# Altium schematic sheet DAC8802程控放大器.SchDoc
size A4
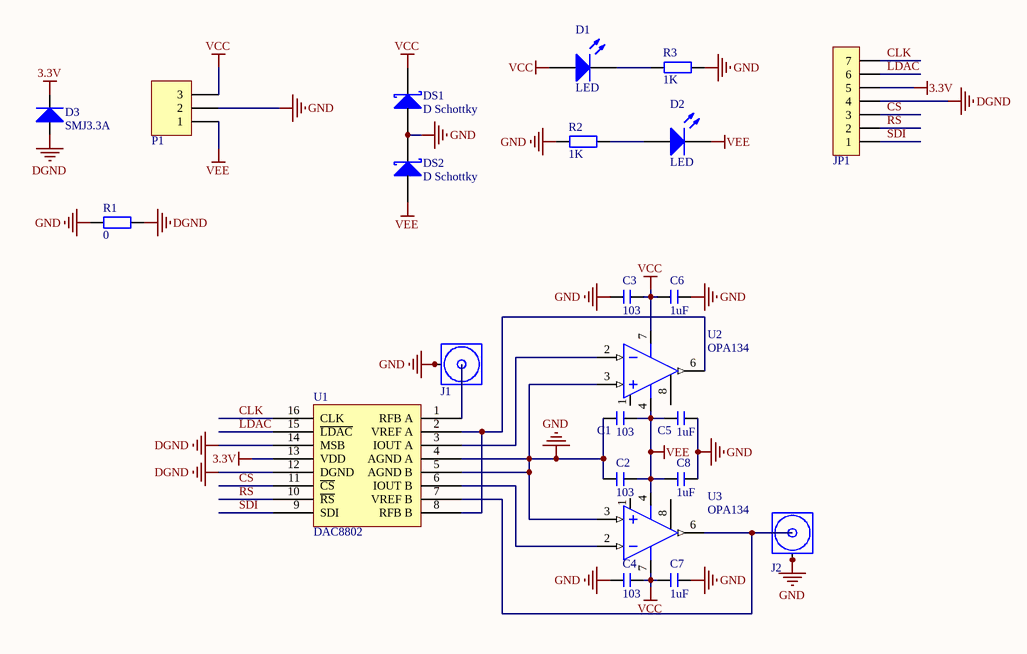
[diagram p0: DAC8802程控放大器.SchDoc]

## Parts
C1  103  [C 0603]
C2  103  [C 0603]
C3  103  [C 0603]
C4  103  [C 0603]
C5  1uF  [C 0603]
C6  1uF  [C 0603]
C7  1uF  [C 0603]
C8  1uF  [C 0603]
D1  LED  [LED_0805]
D2  LED  [LED_0805]
D3  Type: SMJ3.3A  [DIODE-SMA]  (hidden comment: TVS)
DS1  D Schottky  [DIODE-SMA]
DS2  D Schottky  [DIODE-SMA]
J1  COAX  [MCX5.08-5-H]  (value not drawn)
J2  COAX  [MCX5.08-5-H]  (value not drawn)
JP1  HDR-1X7  [HDR-1X7]  (value not drawn)
P1  Header 3  [HDR3X1_B2]  (value not drawn)
R1  0  [R 0603]
R2  1K  [R 0805]
R3  1K  [R 0805]
U1  DAC8802  [TSSOP16_M]
U2  OPA134  [SOIC8_N]
U3  OPA134  [SOIC8_N]

## Nets
3.3V: D3.2(K) JP1.5 U1.13(VDD)
DGND: D3.1(A) JP1.4 R1.2 U1.12(DGND) U1.14(MSB)
GND: C1.2 C2.2 C3.2 C4.2 C5.1 C6.1 C7.1 C8.1 DS1.1 DS2.2 J1.2(GND) J1.3(GND) J1.4(GND) J1.5(GND) J2.2(GND) J2.3(GND) J2.4(GND) J2.5(GND) P1.2 R1.1 R2.1 R3.2 U1.4(AGND_A) U1.5(AGND_B) U2.3(IN+) U3.3(IN+)
VCC: C3.1 C4.1 C6.2 C7.2 D1.1(A) DS1.2 P1.3 U2.7(V+) U3.7(V+)
VEE: C1.1 C2.1 C5.2 C8.2 D2.2(K) DS2.1 P1.1 U2.4(V-) U3.4(V-)
CLK: JP1.7 U1.16(CLK)
CS: JP1.3 U1.11(~{CS})
LDAC: JP1.6 U1.15(~{LDAC})
RS: JP1.2 U1.10(~{RS})
SDI: JP1.1 U1.9(SDI)
NetD1_2: D1.2(K) R3.1
NetD2_1: D2.1(A) R2.2
NetJ1_1: J1.1(Signal) U1.1(RFB_A)
NetJ2_1: J2.1(Signal) U1.7(VREF_B) U3.6(OUT)
NetU1_2: U1.2(VREF_A) U1.8(RFB_B) U2.6(OUT)
NetU1_3: U1.3(IOUT_A) U2.2(IN-)
NetU1_6: U1.6(IOUT_B) U3.2(IN-)

Not connected (* = marked no-connect by the designer): U2 1(OFFSET_N1) 8(OFFSET_N2); U3 1(OFFSET_N1) 8(OFFSET_N2)

## Library data of the parts
C1-C8 = C: 无极性贴片电容; 版权归属: 源创客; BOM名称: 无极性贴片电容; 学习资源: www.ooocke.com
D1 D2 = LED: 发光二极管; Published: 8-Jun-2000; LatestRevisionDate: 08-Jul-2005; LatestRevisionNote: Mech Layer 1 removed.; PackageReference: LED; Publisher: Altium Limited
D3 = TVS: TVS保护; Published: 8-Jun-2000; LatestRevisionDate: 17-Jul-2002; LatestRevisionNote: Re-released for DXP Platform.; PackageDocument: Sep-1996; PackageReference: SMC; Publisher: Altium Limited; Code_JEDEC: DO-214-AB
DS1 DS2 = D Schottky: Schottky Diode; Published: 8-Jun-2000; LatestRevisionDate: 17-Jul-2002; LatestRevisionNote: Re-released for DXP Platform.; PackageReference: SMB; Publisher: Altium Limited; PackageDescription: DO-214-AA/SMB; 2 C-Bend Leads; Body 5.3 x 3.6 mm, inc. leads (LxW); Code_JEDEC: DO-214-AA
JP1 = Header 7: 7P接插件; 版权归属: 源创客; BOM名称: 7P接插件; 学习资源: www.ooocke.com
P1 = Header 3: 接插件; LatestRevisionDate: 17-Jul-2002; LatestRevisionNote: Re-released for DXP Platform.; Publisher: Altium Limited
R1-R3 = R: 贴片电阻; 版权归属: 源创客; BOM名称: 贴片电阻; 学习资源: www.ooocke.com
U1 = DAC8802: Dual.Serial Input 14Bit Multiplying Digital-to-Analog Converter
U2 U3 = OPA134: 高性能音频运算放大器